# Altium schematic sheet Sheet2.SchDoc
size A
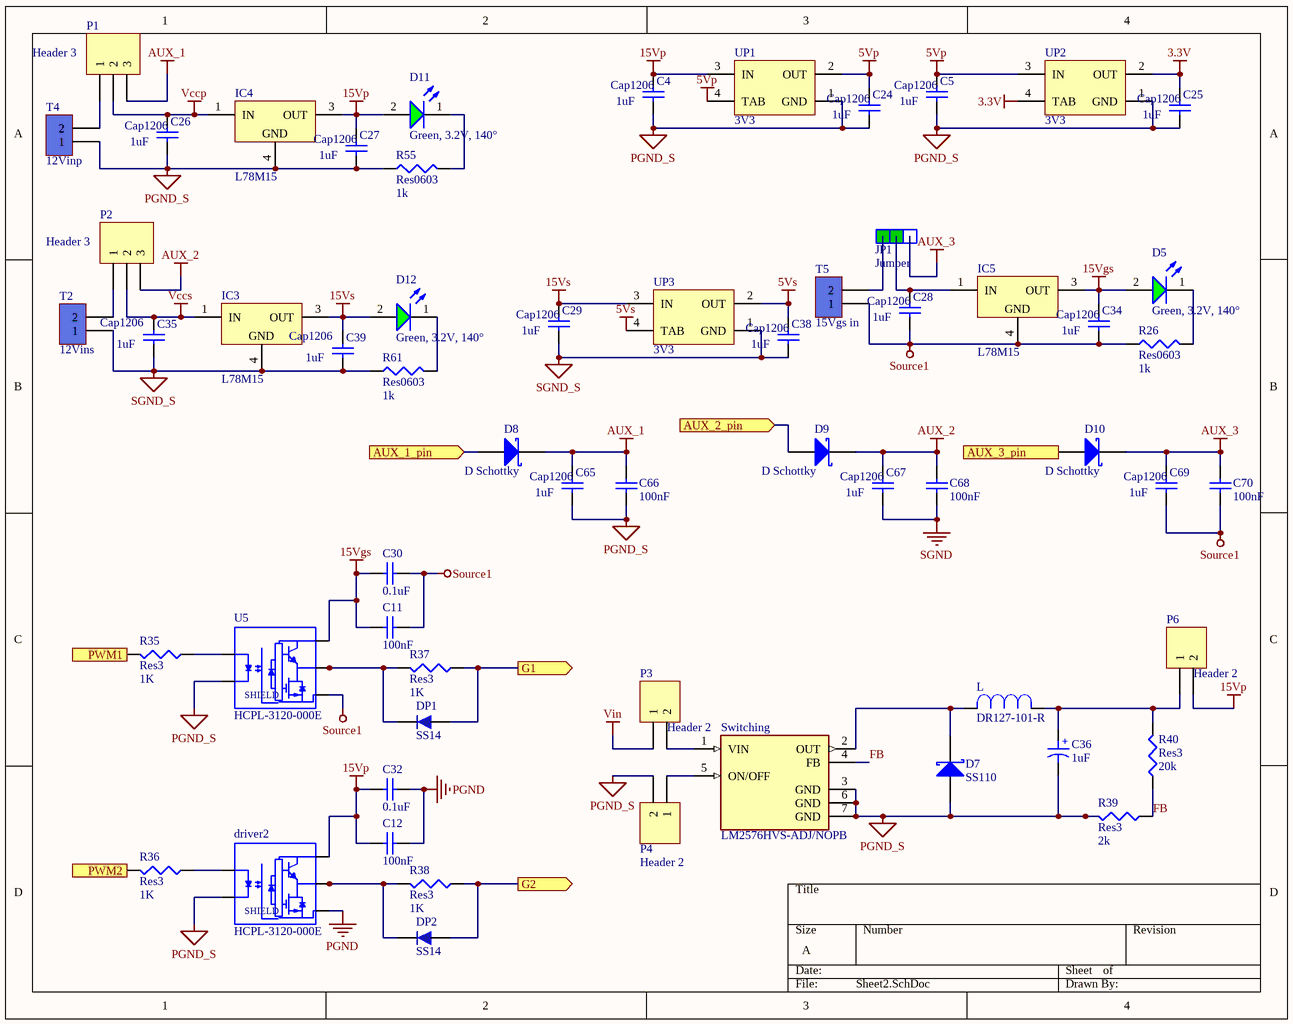
[diagram p0: Sheet2.SchDoc]

## Parts
C4  Cap1206  value 1uF  [C1206]
C5  Cap1206  value 1uF  [C1206]
C11  100nF  [CAP0603]
C12  100nF  [CAP0603]
C24  Cap1206  value 1uF  [C1206]
C25  Cap1206  value 1uF  [C1206]
C26  Cap1206  value 1uF  [C1206]
C27  Cap1206  value 1uF  [C1206]
C28  Cap1206  value 1uF  [C1206]
C29  Cap1206  value 1uF  [C1206]
C30  0.1uF  [CAPC4817X12N]
C32  0.1uF  [CAPC4817X12N]
C34  Cap1206  value 1uF  [C1206]
C35  Cap1206  value 1uF  [C1206]
C36  1uF  [Cap electrolitic radial 8x12-3.5]
C38  Cap1206  value 1uF  [C1206]
C39  Cap1206  value 1uF  [C1206]
C65  Cap1206  value 1uF  [C1206]
C66  100nF  [Cap SMD 100UF 35~50v]
C67  Cap1206  value 1uF  [C1206]
C68  100nF  [Cap SMD 100UF 35~50v]
C69  Cap1206  value 1uF  [C1206]
C70  100nF  [Cap SMD 100UF 35~50v]
D5  Green, 3.2V, 140°  [WL-SMCW_0805_150080xx75000]
D7  SS110  [SMB]
D8  D Schottky  [SMB]
D9  D Schottky  [SMB]
D10  D Schottky  [SMB]
D11  Green, 3.2V, 140°  [WL-SMCW_0805_150080xx75000]
D12  Green, 3.2V, 140°  [WL-SMCW_0805_150080xx75000]
DP1  SS14  [430X270D]
DP2  SS14  [430X270D]
driver2  HCPL-3120-000E  [DIP762W65P254L990H470Q8]
IC3  L78M15  [TO-252]
IC4  L78M15  [TO-252]
IC5  L78M15  [TO-252]
JP1  Jumper  [jumper selector]
L  DR127-101-R  [INDM125125X800N]
P1  Header 3  [HDR1X3]
P2  Header 3  [HDR1X3]
P3  Header 2  [HDR1X2]
P4  Header 2  [HDR1X2]
P6  Header 2  [HDR1X2]
R26  Res0603  value 1k  [J1-0603]
R35  Res3  value 1K  [J1-0603]
R36  Res3  value 1K  [J1-0603]
R37  Res3  value 1K  [J1-0603]
R38  Res3  value 1K  [J1-0603]
R39  Res3  value 2k  [J1-0603]
R40  Res3  value 20k  [J1-0603]
R55  Res0603  value 1k  [J1-0603]
R61  Res0603  value 1k  [J1-0603]
Switching  LM2576HVS-ADJ/NOPB  [REG_LM2576HVS-ADJ/NOPB]
T2  12Vins  [KF301 2PIN]
T4  12Vinp  [KF301 2PIN]
T5  15Vgs in  [KF301 2PIN]
U5  HCPL-3120-000E  [DIP762W65P254L990H470Q8]
UP1  3V3  [SOT223]
UP2  3V3  [SOT223]
UP3  3V3  [SOT223]

## Ports
AUX_1_pin (in), AUX_2_pin (in), AUX_3_pin (in), G1 (out), G2 (out), PWM1 (in), PWM2 (in)

## Nets
3.3V: C25.1 UP2.2(OUT) UP2.4(TAB)
5Vp: C5.1 C24.1 UP1.2(OUT) UP1.4(TAB) UP2.3(IN)
5Vs: C38.1 UP3.2(OUT) UP3.4(TAB)
15Vgs: C11.2 C30.2 C34.1 D5.2(A) IC5.3(OUT) U5.8(VCC)
15Vp: C4.1 C12.2 C27.1 C32.2 D11.2(A) driver2.8(VCC) IC4.3(OUT) P6.2 UP1.3(IN)
15Vs: C29.1 C39.1 D12.2(A) IC3.3(OUT) UP3.3(IN)
AUX_1: C65.1 C66.2 D8.2(K) P1.3
AUX_2: C67.1 C68.2 D9.2(K) P2.3
AUX_3: C69.1 C70.2 D10.2(K) JP1.3
PGND: C12.1 C32.1 driver2.5(VEE)
PGND_S: C4.2 C5.2 C24.2 C25.2 C26.2 C27.2 C36.2 C65.2 C66.1 D7.1(A) driver2.3(CATHODE) IC4.4(GND) P4.2 R39.2 R55.1 Switching.3(GND) Switching.6(GND) Switching.7(GND) T4.1 U5.3(CATHODE) UP1.1(GND) UP2.1(GND)
SGND: C67.2 C68.1
SGND_S: C29.2 C35.2 C38.2 C39.2 IC3.4(GND) R61.1 T2.1 UP3.1(GND)
Source1: C11.1 C28.2 C30.1 C34.2 C69.2 C70.1 IC5.4(GND) R26.1 T5.1 U5.5(VEE)
Vccp: C26.1 IC4.1(IN) P1.2
Vccs: C35.1 IC3.1(IN) P2.2
Vin: P3.1
AUX_1_pin: D8.1(A) ; port AUX_1_pin
AUX_2_pin: D9.1(A) ; port AUX_2_pin
AUX_3_pin: D10.1(A) ; port AUX_3_pin
FB: R39.1 R40.1 Switching.4(FB)
G1: DP1.1 R37.1 ; port G1
G2: DP2.1 R38.1 ; port G2
PWM1: R35.2 ; port PWM1
PWM2: R36.2 ; port PWM2
NetC28_1: C28.1 IC5.1(IN) JP1.2
NetC36_1: C36.1 L.1 P6.1 R40.2
NetD5_1: D5.1(K) R26.2
NetD7_2: D7.2(K) L.2 Switching.2(OUT)
NetD11_1: D11.1(K) R55.2
NetD12_1: D12.1(K) R61.2
NetDP1_2: DP1.2 R37.2 U5.6(VO) U5.7(VO)
NetDP2_2: DP2.2 driver2.6(VO) driver2.7(VO) R38.2
Netdriver2_2: driver2.2(ANODE) R36.1
NetJP1_1: JP1.1 T5.2
NetP1_1: P1.1 T4.2
NetP2_1: P2.1 T2.2
NetP3_2: P3.2 Switching.1(VIN)
NetP4_1: P4.1 Switching.5(ON/OFF)
NetR35_1: R35.1 U5.2(ANODE)

## Notes on the sheet
- (in symbol Cap ELECTROLITIC TOTAL SIZE) +
- (in symbol HCPL-3120-000E) SHIELD

## Library data of the parts
C4 C5 C24-C29 C34 C35 C38 C39 C65 C67 C69 = Cap Semi: CAP, CERM, 1uF, 50V, +/-20%, X7R, 1206; Published: 8-Jun-2000; LatestRevisionDate: 29-May-2009; LatestRevisionNote: IPC-7351 Footprint Added.; PackageReference: C1206; Publisher: Altium Limited; PackageDescription: Chip Capacitor
C11 C12 C66 C68 C70 = CAP SMD PACKAGE: TOTAL CAPACITOR SMD PACK; Designer: Abbas Basereh; Desc.: CAP SMD TOTAL PACKAGES; Data: 2017-3-10; VALUE: 100nF
C30 C32 = CAP SMD 1206: CAP 1206; Designer: Abbas Basereh; Desc.: CAP SMD 1206; Data: 16-12-2016
C36 = Cap ELECTROLITIC TOTAL SIZE: Cap electrolitic radial; Designer: Abbas Basereh; Data: 16-12-2016; Part. No: *; VALUE: 1uF
D5 D11 D12 = 150080GS75000: WL-SMCW Mono-color Chip LED Waterclear, SMT, size 0805, Green, 3.2V, 140°; Manufacturer: Wurth Elektronik; Case/Size Code: 0805; Chip Technology: InGaN; Dominant Wavelength: 525nm; Luminous Intensity: 450mcd; Peak Wavelength: 515nm; Manufacturer Part Number: 150080GS75000; Category: Signal LEDs; Match Code: WL-SMCW; ComponentLink1Description: Website Link; ComponentLink1URL: https://www.we-online.com/redexpert/article/150080GS75000?ad; ComponentLink2Description: Datasheet Link; ComponentLink2URL: https://www.we-online.com/redexpert/spec/150080GS75000?ad; Mount: Surface Mount; Operating Temperature Max: 85°C; Operating Temperature Min: -40°C; Packaging: Tape and Reel; Length: 2mm; Width: 1.25mm; Height: 0.7mm; Emitting Color: Green; Forward Voltage: 3.2V; Viewing Angle: 140°
D7-D10 = D Schottky: Schottky Diode; Published: 8-Jun-2000; LatestRevisionDate: 17-Jul-2002; LatestRevisionNote: Re-released for DXP Platform.; PackageReference: SMB; Publisher: Altium Limited; PackageDescription: DO-214-AA/SMB; 2 C-Bend Leads; Body 5.3 x 3.6 mm, inc. leads (LxW); Code_JEDEC: DO-214-AA
DP1 DP2 = 1N5819: Schottkey Rectifiers; Designer: Abbas Basereh; Data: 16-12-2016; Link: *; Part. No: *
driver2 U5 = HCPL-3120-000E: 2.5A Gate Driver Optical Coupling 3750Vrms 1 Channel 8-DIP; MF: Broadcom Limited; Package: DIP-8 Broadcom; Value: *; Price: None; MP: HCPL-3120-000E; Availability: Unavailable; SnapEDA_Link: https://www.snapeda.com/parts/HCPL-3120-000E/Broadcom%20Limited/view-part/1774478/?ref=snap
IC3-IC5 = L78M05: Precision 500mA Regulator
JP1 = Jumper Selector
L = DR127-101-R: 100ÂµH Shielded Wirewound Inductor 1.96A 163mOhm Nonstandard; MF: Eaton; Package: Nonstandard Eaton; Price: None; SnapEDA_Link: https://www.snapeda.com/parts/DR127-101-R/Eaton/view-part/2755655/?ref=snap; Value: *; MP: DR127-101-R; Availability: Unavailable
P1 P2 = Header 3: Header, 3-Pin; LatestRevisionDate: 17-Jul-2002; LatestRevisionNote: Re-released for DXP Platform.; Publisher: Altium Limited
P3 P4 P6 = Header 2: Header, 2-Pin, 100mill; LatestRevisionDate: 17-Jul-2002; LatestRevisionNote: Re-released for DXP Platform.; Publisher: Altium Limited
R26 R55 R61 = Res3: RES, 1k ohm, 1%, 0.1W, 0603; Published: 8-Jun-2000; LatestRevisionDate: 29-May-2009; LatestRevisionNote: IPC-7351 Footprint Added.; PackageReference: J1-0603; Publisher: Altium Limited; PackageDescription: Chip Resistor
R35-R40 = Res3: Resistor; Published: 8-Jun-2000; LatestRevisionDate: 29-May-2009; LatestRevisionNote: IPC-7351 Footprint Added.; PackageReference: J1-0603; Publisher: Altium Limited; PackageDescription: Chip Resistor
Switching = LM2576HVS-ADJ/NOPB: Buck Switching Regulator IC Positive Adjustable 1.23V 1 Output 3A TO-263-6, DÂ²Pak _5 Leads + Tab_, TO-263BA; MF: Texas Instruments; Value: *; Price: None; MP: LM2576HVS-ADJ/NOPB; SnapEDA_Link: https://www.snapeda.com/parts/LM2576HVS-ADJ/NOPB/Texas%20Instruments/view-part/213619/?ref=snap; Package: TO-263-5 Texas Instruments; Availability: Unavailable
T2 T4 T5 = KF301-2Pin_Terminal: Terminal 2 Pin 250VAC 16A; Part. No: KF301 2P; Designer: Abbas Basereh; Link: https://www.aliexpress.com/item/
UP1-UP3 = AMS1117-x.x: x.x Volt, 800mA Low-Dropout Linear Regulator, 4-pin SOT-223; Designer: Ali Hafizi; Data: 16-12-2016